# Altium schematic sheet USART.SchDoc
size A4
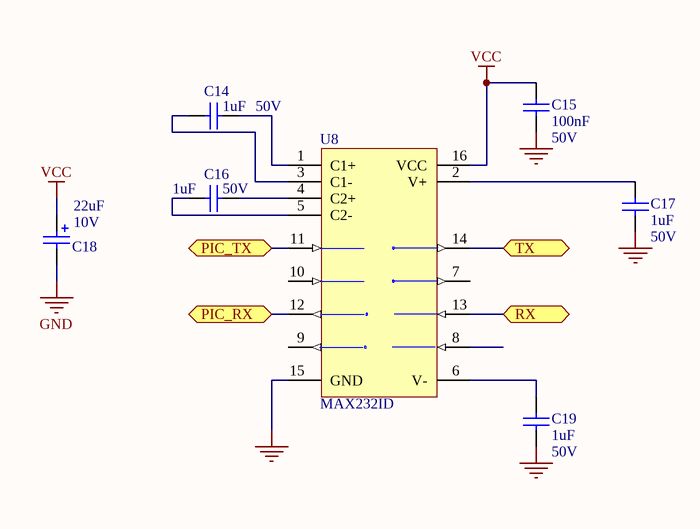
[diagram p0: USART.SchDoc]

## Parts
C14  value 1uF  Voltage: 50V  [3-0603_L]  (hidden comment: Cap)
C15  value 100nF  Voltage: 50V  [3-0603_L]  (hidden comment: Cap)
C16  value 1uF  Voltage: 50V  [3-0603_L]  (hidden comment: Cap)
C17  value 1uF  Voltage: 50V  [3-0603_L]  (hidden comment: Cap)
C18  value 22uF  Voltage: 10V  [3528]  (hidden comment: CAP-Tantal)
C19  value 1uF  Voltage: 50V  [3-0603_L]  (hidden comment: Cap)
U8  MAX232ID  [SOIC16 - big]

## Ports
PIC_RX (bidir), PIC_TX (bidir), RX (bidir), TX (bidir)

## Nets
GND: C15.1 C17.1 C18.2 C19.1 U8.15(GND)
VCC: C15.2 C18.1 U8.16(VCC)
PIC_RX: U8.12(R1OUT) ; port PIC_RX
PIC_TX: U8.11(T1IN) ; port PIC_TX
RX: U8.13(R1IN) ; port RX
TX: U8.14(T1OUT) ; port TX
NetC14_1: C14.1 U8.1(C1+)
NetC14_2: C14.2 U8.3(C1-)
NetC16_1: C16.1 U8.4(C2+)
NetC16_2: C16.2 U8.5(C2-)
NetC17_2: C17.2 U8.2(V+)
NetC19_2: C19.2 U8.6(V-)

Not connected (* = marked no-connect by the designer): U8 7(T2OUT) 8(R2IN) 9(R2OUT) 10(T2IN)

## Library data of the parts
C14-C17 C19 = Cap: Capacitor; Published: 8-Jun-2000; Revision: July-2002: Re-released for DXP Platform.; Publisher: Altium Limited
C18 = CAP-Tantal: Tantamount Military, Surface Mount MIL-PRF-55365/8 Qualified Solid Tantalum Chip Capacitor: 6.8uF, 20% Tolerance, 6 WVDC @ +85°C, Surge = 8V; Note: See Data Sheet for full range of components; Published: 19-Mar-2004; DatasheetDocument: 20-Mar-2003; PackageReference: 3528; Publisher: Altium Limited; Code_JEITA: 3528; ComponentLink1Description: Manufacturer Link; ComponentLink1URL: http://www.vishay.com/; ComponentLink2Description: Datasheet; ComponentLink2URL: http://www.vishay.com/docs/40011/cwr11.pdf
U8 = MAX232ID: 5V, Low-Power, up to 1Mbps, True RS-232 Transceiver Using Four 0.1µF External Capacitor; Code - JEDEC: MS-012-AC; Code - IPC: SO16; Published: 16-Jan-2001; Revision: 17-Jul-2002: Re-released for DXP Platform.; Datasheet: Latest Revision: Mar-1999; Package Reference: NSO16; Publisher: Altium Limited